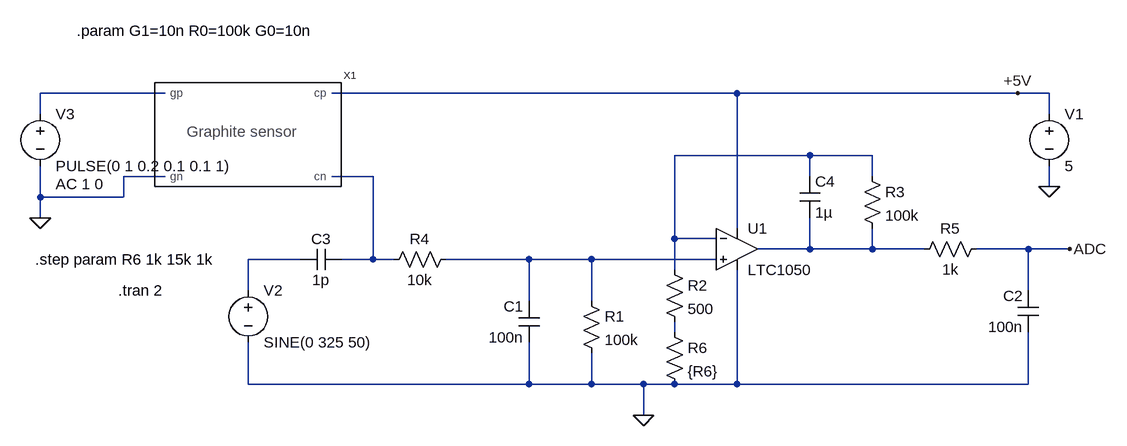
[diagram p0: schematic Projet_grindal_mariez_elec_simulation_2.asc]
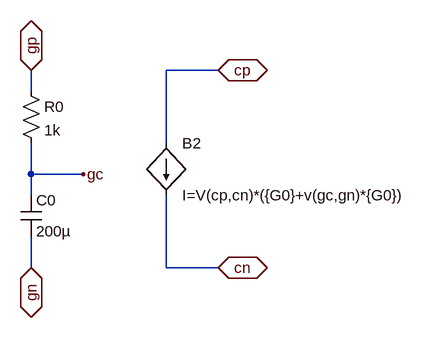
[diagram p1: sub-circuit graphite_sensor.asc]
Projet_grindal_mariez_elec_simulation_2.asc, the LTspice schematic file:
Version 4
SHEET 1 944 760
WIRE -512 80 -704 80
WIRE 368 80 -256 80
WIRE 800 80 368 80
WIRE 848 80 800 80
WIRE -704 112 -704 80
WIRE 848 112 848 80
WIRE 480 176 272 176
WIRE 576 176 480 176
WIRE -512 208 -576 208
WIRE -192 208 -256 208
WIRE 480 208 480 176
WIRE 576 208 576 176
WIRE 848 224 848 192
WIRE -704 240 -704 192
WIRE -576 240 -576 208
WIRE -576 240 -704 240
WIRE -704 272 -704 240
WIRE 368 288 368 80
WIRE 272 304 272 176
WIRE 336 304 272 304
WIRE 480 320 480 272
WIRE 480 320 400 320
WIRE 576 320 576 288
WIRE 576 320 480 320
WIRE 656 320 576 320
WIRE 816 320 736 320
WIRE 880 320 816 320
WIRE -304 336 -384 336
WIRE -192 336 -192 208
WIRE -192 336 -240 336
WIRE -160 336 -192 336
WIRE 48 336 -80 336
WIRE 144 336 48 336
WIRE 336 336 144 336
WIRE 272 352 272 304
WIRE -384 384 -384 336
WIRE 816 384 816 320
WIRE 48 400 48 336
WIRE 144 400 144 336
WIRE 272 448 272 432
WIRE -384 528 -384 464
WIRE 48 528 48 464
WIRE 48 528 -384 528
WIRE 144 528 144 480
WIRE 144 528 48 528
WIRE 224 528 144 528
WIRE 272 528 224 528
WIRE 368 528 368 352
WIRE 368 528 272 528
WIRE 816 528 816 448
WIRE 816 528 368 528
WIRE 224 576 224 528
FLAG 224 576 0
FLAG 848 224 0
FLAG 880 320 ADC
FLAG 800 80 +5V
FLAG -704 272 0
SYMBOL cap 64 464 R180
WINDOW 0 24 56 Left 2
WINDOW 3 24 8 Left 2
SYMATTR InstName C1
SYMATTR Value 100n
SYMBOL cap 832 448 R180
WINDOW 0 24 56 Left 2
WINDOW 3 24 8 Left 2
SYMATTR InstName C2
SYMATTR Value 100n
SYMBOL cap -304 352 R270
WINDOW 0 32 32 VTop 2
WINDOW 3 0 32 VBottom 2
SYMATTR InstName C3
SYMATTR Value 1p
SYMBOL cap 464 208 R0
SYMATTR InstName C4
SYMATTR Value 1µ
SYMBOL res 128 384 R0
SYMATTR InstName R1
SYMATTR Value 100k
SYMBOL res 256 432 R0
SYMATTR InstName R6
SYMATTR Value {R6}
SYMBOL res 560 192 R0
SYMATTR InstName R3
SYMATTR Value 100k
SYMBOL res -64 320 R90
WINDOW 0 0 56 VBottom 2
WINDOW 3 32 56 VTop 2
SYMATTR InstName R4
SYMATTR Value 10k
SYMBOL res 752 304 R90
WINDOW 0 0 56 VBottom 2
WINDOW 3 32 56 VTop 2
SYMATTR InstName R5
SYMATTR Value 1k
SYMBOL OpAmps\\LTC1050 368 256 R0
SYMATTR InstName U1
SYMBOL voltage 848 96 R0
WINDOW 123 0 0 Left 0
WINDOW 39 0 0 Left 0
SYMATTR InstName V1
SYMATTR Value 5
SYMBOL voltage -384 368 R0
WINDOW 123 24 124 Left 2
WINDOW 39 0 0 Left 0
SYMATTR InstName V2
SYMATTR Value SINE(0 325 50)
SYMBOL voltage -704 96 R0
WINDOW 123 24 124 Left 2
WINDOW 39 0 0 Left 0
SYMATTR Value2 AC 1 0
SYMATTR InstName V3
SYMATTR Value PULSE(0 1 0.2 0.1 0.1 1)
SYMBOL graphite_sensor -384 144 R0
SYMATTR InstName X1
SYMBOL res 256 336 R0
SYMATTR InstName R2
SYMATTR Value 500
TEXT -648 -16 Left 2 !.param G1=10n R0=100k G0=10n
TEXT -584 384 Left 2 !.tran 2
TEXT -712 336 Left 2 !.step param R6 1k 15k 1k

graphite_sensor.asc, the sub-circuit schematic file:
Version 4
SHEET 1 996 680
WIRE 640 16 560 16
WIRE 352 48 352 16
WIRE 560 128 560 16
WIRE 352 176 352 128
WIRE 432 176 352 176
WIRE 352 208 352 176
WIRE 352 320 352 272
WIRE 560 320 560 208
WIRE 640 320 560 320
FLAG 352 16 gp
IOPIN 352 16 BiDir
FLAG 352 320 gn
IOPIN 352 320 BiDir
FLAG 640 16 cp
IOPIN 640 16 BiDir
FLAG 640 320 cn
IOPIN 640 320 BiDir
FLAG 432 176 gc
SYMBOL res 336 32 R0
SYMATTR InstName R0
SYMATTR Value 1k
SYMBOL cap 336 208 R0
SYMATTR InstName C0
SYMATTR Value 200µ
SYMBOL bi 560 128 R0
SYMATTR InstName B2
SYMATTR Value I=V(cp,cn)*({G0}+v(gc,gn)*{G0})

The netlist it stands for:
* Projet_grindal_mariez_elec_simulation_2.asc
C1 0 N006 100n
C2 0 ADC 100n
C3 N005 N003 1p
C4 N002 N004 1µ
R1 N006 0 100k
R6 N007 0 {R6}
R3 N002 N004 100k
R4 N006 N003 10k
R5 ADC N004 1k
XU1 N006 N002 +5V 0 N004 LTC1050  ; pins In+ In- V+ V- OUT
V1 +5V 0 5
V2 N005 0 SINE(0 325 50)
V3 N001 0 PULSE(0 1 0.2 0.1 0.1 1) AC 1 0
XX1 0 N003 N001 +5V graphite_sensor
R2 N002 N007 500

* block symbol definitions
.subckt graphite_sensor gn cn gp cp
R0 gp gc 1k
C0 gc gn 200µ
B2 cp cn I=V(cp,cn)*({G0}+v(gc,gn)*{G0})
.ends graphite_sensor

.param G1=10n R0=100k G0=10n
.tran 2
.step param R6 1k 15k 1k
.lib LTC.lib
.backanno
.end